# Altium project DAQ_PCB.PrjPcb
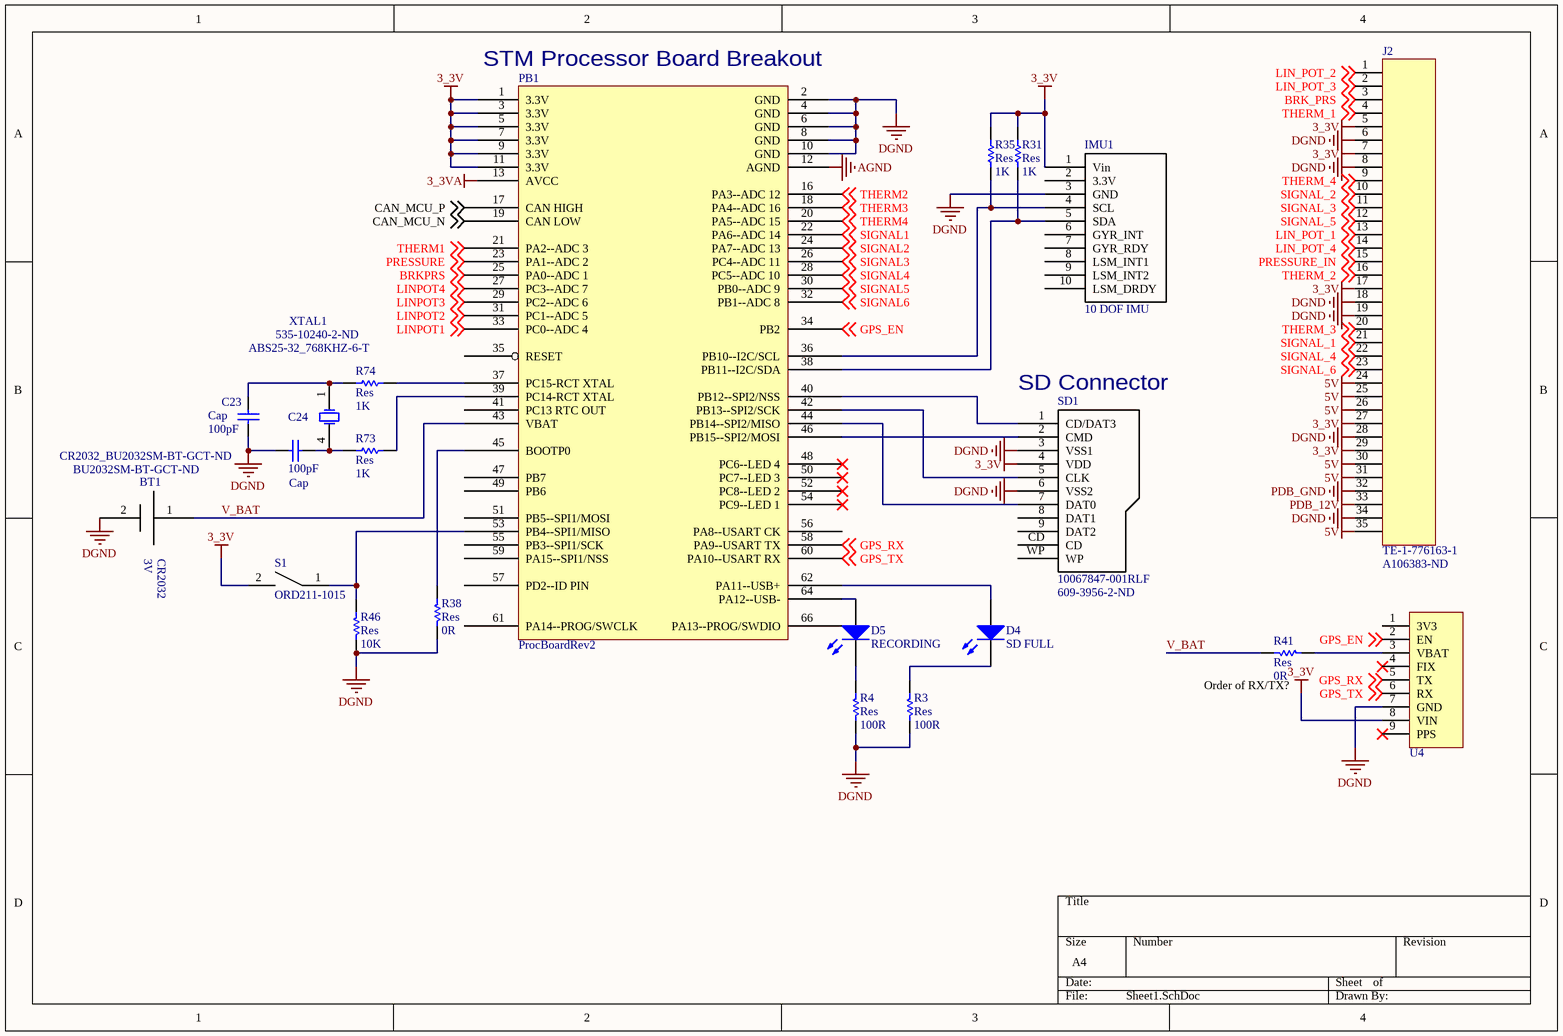
[diagram p0: Sheet1.SchDoc]
3 sheets, 156 parts. Net scope: global (net labels, ports and power ports of the same name join across sheets).
Board file: PCB1.PcbDoc
Sheets:
  Sheet1.SchDoc
  Sheet2.SchDoc
  Sheet3.SchDoc

## Sheet Sheet1.SchDoc
size A4

### Parts
BT1  CR2032_BU2032SM-BT-GCT-ND  [BU2032SM-BT-GCT-ND]
C23  Cap  value 100pF  [C0805]
C24  Cap  value 100pF  [C0805]
D4  SD FULL  [OVS5MABCR4]
D5  RECORDING  [OVS5MGBCR4]
IMU1  10 DOF IMU  [Adafruit_10DOF_IMU]
J2  TE-1-776163-1  Supplier Part Number 1: A106383-ND  [TE-1-776163-1]
PB1  ProcBoardRev2  [PROC_BOARD]
R3  Res  value 100R  [3216[1206]]
R4  Res  value 100R  [3216[1206]]
R31  Res  value 1K  [2012[0805]]
R35  Res  value 1K  [2012[0805]]
R38  Res  value 0R  [3216[1206]]  (no BOM)
R41  Res  value 0R  [3216[1206]]  (no BOM)
R46  Res  value 10K  [3216[1206]]
R73  Res  value 1K  [2012[0805]]
R74  Res  value 1K  [2012[0805]]
S1  ORD211-1015  [ORD211-1015]
SD1  10067847-001RLF  Supplier Part Number 1: 609-3956-2-ND  [10067847-001RLF]
U4  MTK3339 MODULE  [MTK3339 MODULE]  (value not drawn)
XTAL1  ABS25-32_768KHZ-6-T  Supplier Part Number 1: 535-10240-2-ND  [ABS25-32_768KHZ-6-T]

### Nets
3_3V: IMU1.1(Vin) J2.5 J2.7 J2.17 J2.27 J2.29 PB1.1(3.3V) PB1.3(3.3V) PB1.5(3.3V) PB1.7(3.3V) PB1.9(3.3V) PB1.11(3.3V) R31.1 R35.1 S1.2 SD1.4(VDD) U4.8(VIN)
3_3VA: PB1.13(AVCC)
5V: J2.24 J2.25 J2.26 J2.30 J2.31 J2.35
AGND: PB1.12(AGND)
DGND: BT1.2 C23.1 C24.2 IMU1.3(GND) J2.6 J2.8 J2.18 J2.19 J2.28 J2.34 PB1.2(GND) PB1.4(GND) PB1.6(GND) PB1.8(GND) PB1.10(GND) R3.1 R4.1 R38.1 R46.1 SD1.3(VSS1) SD1.6(VSS2) U4.7(GND)
PDB_12V: J2.33
PDB_GND: J2.32
BRK_PRS: J2.3 ; off-sheet BRK_PRS
BRKPRS: PB1.25(PA0--ADC_1) ; off-sheet BRKPRS
CAN_MCU_N: PB1.19(CAN_LOW) ; off-sheet CAN_MCU_N
CAN_MCU_P: PB1.17(CAN_HIGH) ; off-sheet CAN_MCU_P
GPS_EN: PB1.34(PB2) U4.2(EN) ; off-sheet GPS_EN
GPS_RX: PB1.58(PA9--USART_TX) U4.5(TX) ; off-sheet GPS_RX
GPS_TX: PB1.60(PA10--USART_RX) U4.6(RX) ; off-sheet GPS_TX
LIN_POT_1: J2.13 ; off-sheet LIN_POT_1
LIN_POT_2: J2.1 ; off-sheet LIN_POT_2
LIN_POT_3: J2.2 ; off-sheet LIN_POT_3
LIN_POT_4: J2.14 ; off-sheet LIN_POT_4
LINPOT1: PB1.33(PC0--ADC_4) ; off-sheet LINPOT1
LINPOT2: PB1.31(PC1--ADC_5) ; off-sheet LINPOT2
LINPOT3: PB1.29(PC2--ADC_6) ; off-sheet LINPOT3
LINPOT4: PB1.27(PC3--ADC_7) ; off-sheet LINPOT4
PRESSURE: PB1.23(PA1--ADC_2) ; off-sheet PRESSURE
PRESSURE_IN: J2.15 ; off-sheet PRESSURE_IN
SIGNAL1: PB1.22(PA6--ADC_14) ; off-sheet SIGNAL1
SIGNAL2: PB1.24(PA7--ADC_13) ; off-sheet SIGNAL2
SIGNAL3: PB1.26(PC4--ADC_11) ; off-sheet SIGNAL3
SIGNAL4: PB1.28(PC5--ADC_10) ; off-sheet SIGNAL4
SIGNAL5: PB1.30(PB0--ADC_9) ; off-sheet SIGNAL5
SIGNAL6: PB1.32(PB1--ADC_8) ; off-sheet SIGNAL6
SIGNAL_1: J2.21 ; off-sheet SIGNAL_1
SIGNAL_2: J2.10 ; off-sheet SIGNAL_2
SIGNAL_3: J2.11 ; off-sheet SIGNAL_3
SIGNAL_4: J2.22 ; off-sheet SIGNAL_4
SIGNAL_5: J2.12 ; off-sheet SIGNAL_5
SIGNAL_6: J2.23 ; off-sheet SIGNAL_6
THERM1: PB1.21(PA2--ADC_3) ; off-sheet THERM1
THERM2: PB1.16(PA3--ADC_12) ; off-sheet THERM2
THERM3: PB1.18(PA4--ADC_16) ; off-sheet THERM3
THERM4: PB1.20(PA5--ADC_15) ; off-sheet THERM4
THERM_1: J2.4 ; off-sheet THERM_1
THERM_2: J2.16 ; off-sheet THERM_2
THERM_3: J2.20 ; off-sheet THERM_3
THERM_4: J2.9 ; off-sheet THERM_4
V_BAT: BT1.1 PB1.43(VBAT) R41.2
NetC23_2: C23.2 R74.2 XTAL1.1(OSC1)
NetC24_1: C24.1 R73.2 XTAL1.4(OSC4)
NetD4_1: D4.1(A) PB1.62(PA11--USB+)
NetD4_2: D4.2(K) R3.2
NetD5_1: D5.1(A) PB1.64(PA12--USB-)
NetD5_2: D5.2(K) R4.2
NetIMU1_4: IMU1.4(SCL) PB1.36(PB10--I2C/SCL) R35.2
NetIMU1_5: IMU1.5(SDA) PB1.38(PB11--I2C/SDA) R31.2
NetPB1_37: PB1.37(PC15-RCT_XTAL) R74.1
NetPB1_39: PB1.39(PC14-RCT_XTAL) R73.1
NetPB1_40: PB1.40(PB12--SPI2/NSS) SD1.1(CD/DAT3)
NetPB1_42: PB1.42(PB13--SPI2/SCK) SD1.5(CLK)
NetPB1_44: PB1.44(PB14--SPI2/MISO) SD1.7(DAT0)
NetPB1_45: PB1.45(BOOTP0) R38.2
NetPB1_46: PB1.46(PB15--SPI2/MOSI) SD1.2(CMD)
NetPB1_53: PB1.53(PB4--SPI1/MISO) R46.2 S1.1
NetR41_1: R41.1 U4.3(VBAT)

Not connected (* = marked no-connect by the designer): IMU1 2(3.3V) 6(GYR_INT) 7(GYR_RDY) 8(LSM_INT1) 9(LSM_INT2) 10(LSM_DRDY); PB1 14(NC) 15(NC) 35(RESET) 41(PC13_RTC_OUT) 47(PB7) 48(PC6--LED_4)* 49(PB6) 50(PC7--LED_3)* 51(PB5--SPI1/MOSI) 52(PC8--LED_2)* 54(PC9--LED_1)* 55(PB3--SPI1/SCK) 56(PA8--USART_CK) 57(PD2--ID_PIN) 59(PA15--SPI1/NSS) 61(PA14--PROG/SWCLK) 63(NC) 65(NC) 66(PA13--PROG/SWDIO) 67; SD1 8(DAT1) 9(DAT2) CD WP; U4 1(3V3) 4(FIX)* 9(PPS)*

### Notes on the sheet
- (near PB1) STM Processor Board Breakout
- (near SD1) SD Connector
- (near R41) Order of RX/TX?
- (in symbol CR2032_BU2032SM-BT-GCT-ND) 3V; CR2032

### Library data of the parts
BT1 = CR2032_BU2032SM-BT-GCT-ND: Coin Cell Battery Holder_BU2032SM-BT-GCT-ND; Supplier: Digikey; Supplier 1: Digi-Key; Supplier Part Number 1: BU2032SM-BT-GCT-ND; Supplier Pt Number: BU2032SM-BT-GCT-ND
C23 C24 = Cap: Capacitor; Published: 8-Jun-2000; LatestRevisionDate: 17-Jul-2002; LatestRevisionNote: Re-released for DXP Platform.; PackageReference: C1206; Publisher: Altium Limited
D4 = OVS5MABCR4: Typical AMBER LED; Published: 8-Jun-2000; LatestRevisionDate: 17-Jul-2002; LatestRevisionNote: Re-released for DXP Platform.; PackageDocument: Feb-2002; PackageReference: 3.2X1.6X1.1; Publisher: Altium Limited; Supplier 1: Digi-Key; Colour: AMBER; Supplier Part Number 1: 365-1543-1-ND
D5 = OVS5MGBCR4: Typical GREEN LED; Published: 8-Jun-2000; LatestRevisionDate: 17-Jul-2002; LatestRevisionNote: Re-released for DXP Platform.; PackageDocument: Feb-2002; PackageReference: 3.2X1.6X1.1; Publisher: Altium Limited; Supplier 1: Digi-Key; Colour: GREEN; Supplier Part Number 1: 365-1545-1-ND
IMU1 = Adafruit_10DOF_IMU
J2 = TE-1-776163-1: CONN HEADER 35POS R/A GOLD BLACK; Supplier 1: Digi-Key
PB1 = ProcBoardRev2: Processor board that carries the STM32F072RB
R3 R4 R31 R35 R38 R41 R46 R73 R74 = Res: Surface Mount Resistor; Published: 8-Jun-2000; LatestRevisionDate: 17-Jul-2002; LatestRevisionNote: Re-released for DXP Platform.; PackageReference: AXIAL-0.5; Publisher: Altium Limited
S1 = ORD211-1015: REED Switch; Manufacturer: Standex-Meder Electronics; Circuit: SPST-NO; Operate Range: 10 ~ 15AT; Current - Switching: 100mA (AC/DC); Voltage - Switching AC: 24V; Power - Rated: 1VA; Operate Time: 0.3ms; Release Time: 0.05ms; Capacitance: 0.20pF; Current - Carry: 300mA (AC/DC); Supplier 1: Digi-Key; Supplier Part Number 1: 374-1083-ND; RoHS: RoHS Compliant; Category: Switches; Stock 1: 4721; Pricing 1: 1=1.15, 10=1.007, 25=0.9664, 50=0.906, 100=0.8858, 250=0.7046, 500=0.64422, 1000=0.62409, 5000=0.56369 (CAD); Packaging: Bulk; Type: Glass Body; Release Range: -; Voltage - Switching DC: 24V; Mounting Type: Through Hole; Termination Style: Axial; Length - Overall: 1.406" (35.70mm); Size - Body: 0.079" Dia x 0.394" L (2.00mm x 10.00mm); Height Above Board: -; Operating Temperature: -; ComponentLink1URL: https://standexelectronics.com/wp-content/uploads/OKI_Reed_Switch_ORD211.pdf; ComponentLink1Description: https://standexelectronics.com/wp-content/uploads/OKI_Reed_Switch_ORD211.pdf; Manufacturer Part Number: ORD211-1015
SD1 = 10067847-001RLF: SD Card Connector; Supplier 1: Digi-Key
U4 = MTK3339 MODULE: GPS Module Breakout
XTAL1 = ABS25-32_768KHZ-6-T: 32.768KHz Crystal Oscillator; Supplier 1: Digi-Key

## Sheet Sheet2.SchDoc
size A2
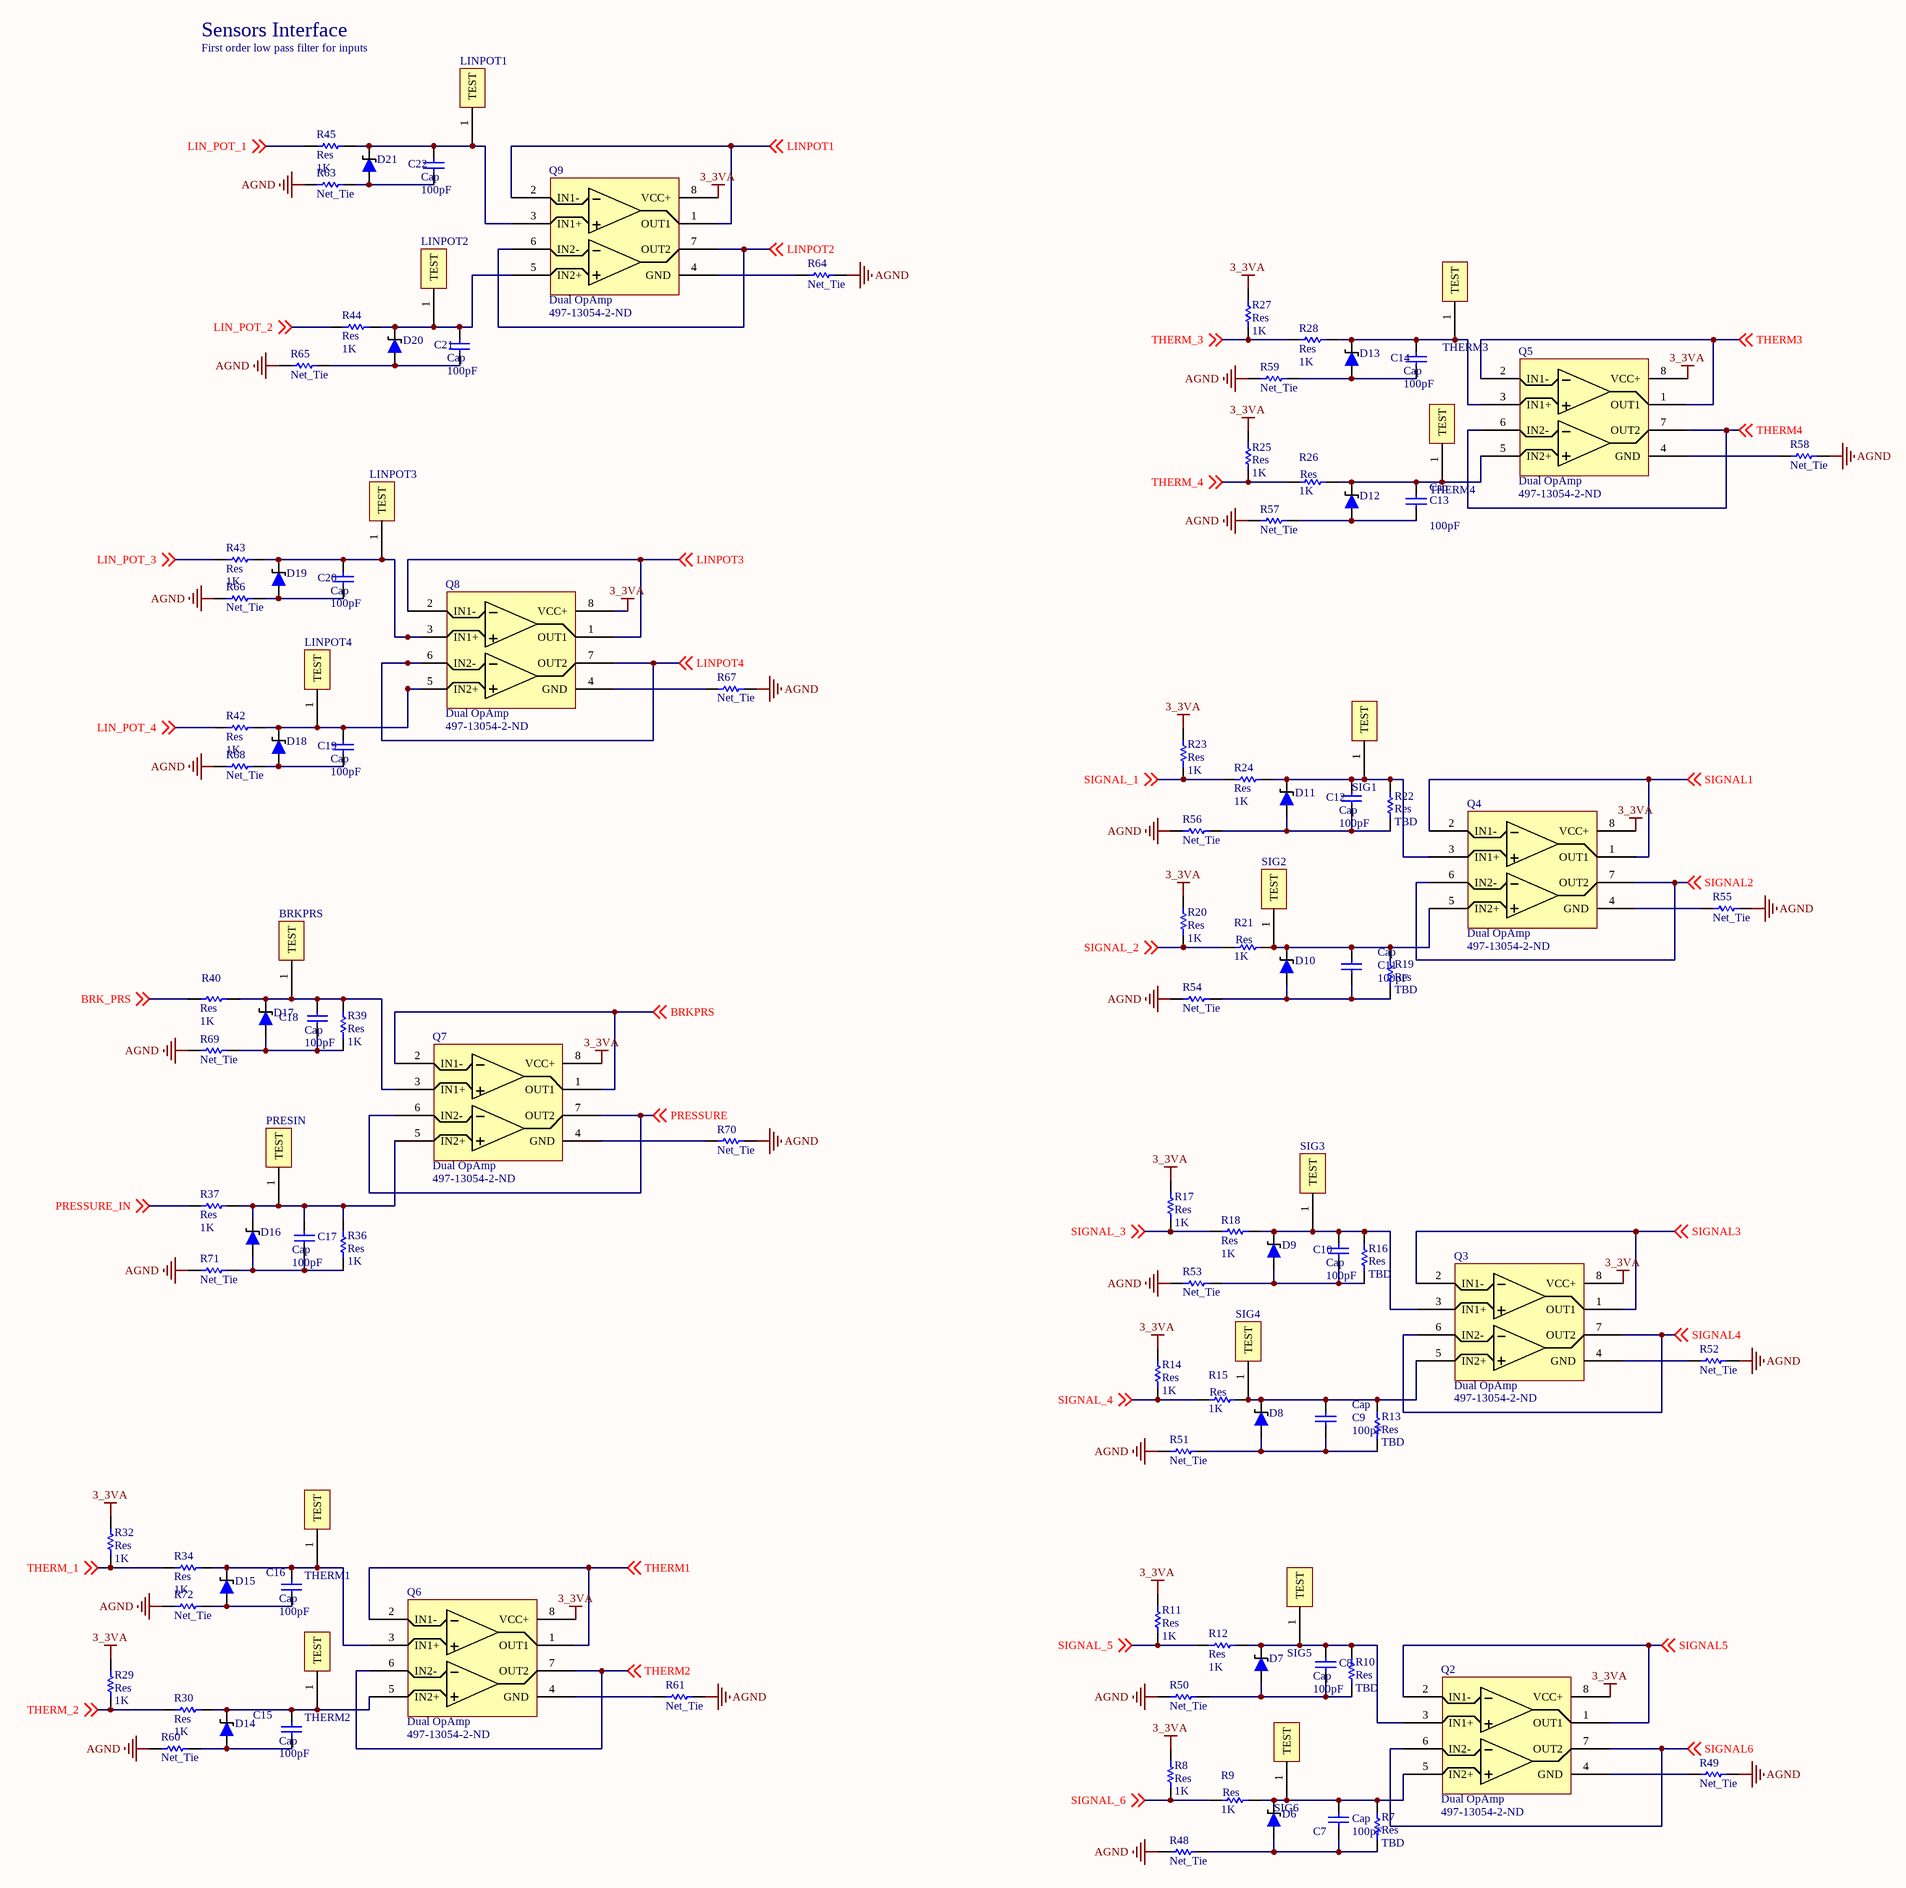
[diagram p1: Sheet2.SchDoc]

### Parts
C7  Cap  value 100pF  [C0805]
C8  Cap  value 100pF  [C0805]
C9  Cap  value 100pF  [C0805]
C10  Cap  value 100pF  [C0805]
C11  Cap  value 100pF  [C0805]
C12  Cap  value 100pF  [C0805]
C13  Cap  value 100pF  [C0805]
C14  Cap  value 100pF  [C0805]
C15  Cap  value 100pF  [C0805]
C16  Cap  value 100pF  [C0805]
C17  Cap  value 100pF  [C0805]
C18  Cap  value 100pF  [C0805]
C19  Cap  value 100pF  [C0805]
C20  Cap  value 100pF  [C0805]
C21  Cap  value 100pF  [C0805]
C22  Cap  value 100pF  [C0805]
D6  MMSZ4684-TP  [MMSZ4684/9]  (value not drawn)
D7  MMSZ4684-TP  [MMSZ4684/9]  (value not drawn)
D8  MMSZ4684-TP  [MMSZ4684/9]  (value not drawn)
D9  MMSZ4684-TP  [MMSZ4684/9]  (value not drawn)
D10  MMSZ4684-TP  [MMSZ4684/9]  (value not drawn)
D11  MMSZ4684-TP  [MMSZ4684/9]  (value not drawn)
D12  MMSZ4684-TP  [MMSZ4684/9]  (value not drawn)
D13  MMSZ4684-TP  [MMSZ4684/9]  (value not drawn)
D14  MMSZ4684-TP  [MMSZ4684/9]  (value not drawn)
D15  MMSZ4684-TP  [MMSZ4684/9]  (value not drawn)
D16  MMSZ4689-TP  [MMSZ4684/9]  (value not drawn)
D17  MMSZ4689-TP  [MMSZ4684/9]  (value not drawn)
D18  MMSZ4684-TP  [MMSZ4684/9]  (value not drawn)
D19  MMSZ4684-TP  [MMSZ4684/9]  (value not drawn)
D20  MMSZ4684-TP  [MMSZ4684/9]  (value not drawn)
D21  MMSZ4684-TP  [MMSZ4684/9]  (value not drawn)
Q2  Dual OpAmp  Supplier Part Number 1: 497-13054-2-ND  [LMV358LIDT]
Q3  Dual OpAmp  Supplier Part Number 1: 497-13054-2-ND  [LMV358LIDT]
Q4  Dual OpAmp  Supplier Part Number 1: 497-13054-2-ND  [LMV358LIDT]
Q5  Dual OpAmp  Supplier Part Number 1: 497-13054-2-ND  [LMV358LIDT]
Q6  Dual OpAmp  Supplier Part Number 1: 497-13054-2-ND  [LMV358LIDT]
Q7  Dual OpAmp  Supplier Part Number 1: 497-13054-2-ND  [LMV358LIDT]
Q8  Dual OpAmp  Supplier Part Number 1: 497-13054-2-ND  [LMV358LIDT]
Q9  Dual OpAmp  Supplier Part Number 1: 497-13054-2-ND  [LMV358LIDT]
R7  Res  value TBD  [2012[0805]]  (no BOM)
R8  Res  value 1K  [2012[0805]]
R9  Res  value 1K  [2012[0805]]
R10  Res  value TBD  [2012[0805]]  (no BOM)
R11  Res  value 1K  [2012[0805]]
R12  Res  value 1K  [2012[0805]]
R13  Res  value TBD  [2012[0805]]  (no BOM)
R14  Res  value 1K  [2012[0805]]
R15  Res  value 1K  [2012[0805]]
R16  Res  value TBD  [2012[0805]]  (no BOM)
R17  Res  value 1K  [2012[0805]]
R18  Res  value 1K  [2012[0805]]
R19  Res  value TBD  [2012[0805]]  (no BOM)
R20  Res  value 1K  [2012[0805]]
R21  Res  value 1K  [2012[0805]]
R22  Res  value TBD  [2012[0805]]  (no BOM)
R23  Res  value 1K  [2012[0805]]
R24  Res  value 1K  [2012[0805]]
R25  Res  value 1K  [2012[0805]]
R26  Res  value 1K  [2012[0805]]
R27  Res  value 1K  [2012[0805]]
R28  Res  value 1K  [2012[0805]]
R29  Res  value 1K  [2012[0805]]
R30  Res  value 1K  [2012[0805]]
R32  Res  value 1K  [2012[0805]]
R34  Res  value 1K  [2012[0805]]
R36  Res  value 1K  [2012[0805]]
R37  Res  value 1K  [2012[0805]]
R39  Res  value 1K  [2012[0805]]
R40  Res  value 1K  [2012[0805]]
R42  Res  value 1K  [2012[0805]]
R43  Res  value 1K  [2012[0805]]
R44  Res  value 1K  [2012[0805]]
R45  Res  value 1K  [2012[0805]]
R48  Net_Tie  [NetTie 0805 10mil]  (net tie, no BOM)
R49  Net_Tie  [NetTie 0805 10mil]  (net tie, no BOM)
R50  Net_Tie  [NetTie 0805 10mil]  (net tie, no BOM)
R51  Net_Tie  [NetTie 0805 10mil]  (net tie, no BOM)
R52  Net_Tie  [NetTie 0805 10mil]  (net tie, no BOM)
R53  Net_Tie  [NetTie 0805 10mil]  (net tie, no BOM)
R54  Net_Tie  [NetTie 0805 10mil]  (net tie, no BOM)
R55  Net_Tie  [NetTie 0805 10mil]  (net tie, no BOM)
R56  Net_Tie  [NetTie 0805 10mil]  (net tie, no BOM)
R57  Net_Tie  [NetTie 0805 10mil]  (net tie, no BOM)
R58  Net_Tie  [NetTie 0805 10mil]  (net tie, no BOM)
R59  Net_Tie  [NetTie 0805 10mil]  (net tie, no BOM)
R60  Net_Tie  [NetTie 0805 10mil]  (net tie, no BOM)
R61  Net_Tie  [NetTie 0805 10mil]  (net tie, no BOM)
R63  Net_Tie  [NetTie 0805 10mil]  (net tie, no BOM)
R64  Net_Tie  [NetTie 0805 10mil]  (net tie, no BOM)
R65  Net_Tie  [NetTie 0805 10mil]  (net tie, no BOM)
R66  Net_Tie  [NetTie 0805 10mil]  (net tie, no BOM)
R67  Net_Tie  [NetTie 0805 10mil]  (net tie, no BOM)
R68  Net_Tie  [NetTie 0805 10mil]  (net tie, no BOM)
R69  Net_Tie  [NetTie 0805 10mil]  (net tie, no BOM)
R70  Net_Tie  [NetTie 0805 10mil]  (net tie, no BOM)
R71  Net_Tie  [NetTie 0805 10mil]  (net tie, no BOM)
R72  Net_Tie  [NetTie 0805 10mil]  (net tie, no BOM)
TP1  SIG6  [TEST POINT 5000K]
TP2  SIG5  [TEST POINT 5000K]
TP3  SIG4  [TEST POINT 5000K]
TP4  SIG3  [TEST POINT 5000K]
TP5  SIG2  [TEST POINT 5000K]
TP6  SIG1  [TEST POINT 5000K]
TP7  THERM4  [TEST POINT 5000K]
TP8  THERM3  [TEST POINT 5000K]
TP9  THERM2  [TEST POINT 5000K]
TP10  THERM1  [TEST POINT 5000K]
TP11  PRESIN  [TEST POINT 5000K]
TP12  BRKPRS  [TEST POINT 5000K]
TP13  LINPOT4  [TEST POINT 5000K]
TP14  LINPOT3  [TEST POINT 5000K]
TP15  LINPOT2  [TEST POINT 5000K]
TP16  LINPOT1  [TEST POINT 5000K]

### Nets
3_3VA: Q2.8(VCC+) Q3.8(VCC+) Q4.8(VCC+) Q5.8(VCC+) Q6.8(VCC+) Q7.8(VCC+) Q8.8(VCC+) Q9.8(VCC+) R8.2 R11.2 R14.2 R17.2 R20.2 R23.2 R25.2 R27.2 R29.2 R32.2
AGND: R48.2 R49.2 R50.2 R51.2 R52.2 R53.2 R54.2 R55.2 R56.2 R57.2 R58.2 R59.2 R60.2 R61.2 R63.1 R64.2 R65.1 R66.2 R67.2 R68.2 R69.2 R70.2 R71.2 R72.2
BRK_PRS: R40.1 ; off-sheet BRK_PRS
BRKPRS: Q7.1(OUT1) Q7.2(IN1-) ; off-sheet BRKPRS
LIN_POT_1: R45.1 ; off-sheet LIN_POT_1
LIN_POT_2: R44.1 ; off-sheet LIN_POT_2
LIN_POT_3: R43.1 ; off-sheet LIN_POT_3
LIN_POT_4: R42.1 ; off-sheet LIN_POT_4
LINPOT1: Q9.1(OUT1) Q9.2(IN1-) ; off-sheet LINPOT1
LINPOT2: Q9.6(IN2-) Q9.7(OUT2) ; off-sheet LINPOT2
LINPOT3: Q8.1(OUT1) Q8.2(IN1-) ; off-sheet LINPOT3
LINPOT4: Q8.6(IN2-) Q8.7(OUT2) ; off-sheet LINPOT4
PRESSURE: Q7.6(IN2-) Q7.7(OUT2) ; off-sheet PRESSURE
PRESSURE_IN: R37.1 ; off-sheet PRESSURE_IN
SIGNAL1: Q4.1(OUT1) Q4.2(IN1-) ; off-sheet SIGNAL1
SIGNAL2: Q4.6(IN2-) Q4.7(OUT2) ; off-sheet SIGNAL2
SIGNAL3: Q3.1(OUT1) Q3.2(IN1-) ; off-sheet SIGNAL3
SIGNAL4: Q3.6(IN2-) Q3.7(OUT2) ; off-sheet SIGNAL4
SIGNAL5: Q2.1(OUT1) Q2.2(IN1-) ; off-sheet SIGNAL5
SIGNAL6: Q2.6(IN2-) Q2.7(OUT2) ; off-sheet SIGNAL6
SIGNAL_1: R23.1 R24.1 ; off-sheet SIGNAL_1
SIGNAL_2: R20.1 R21.1 ; off-sheet SIGNAL_2
SIGNAL_3: R17.1 R18.1 ; off-sheet SIGNAL_3
SIGNAL_4: R14.1 R15.1 ; off-sheet SIGNAL_4
SIGNAL_5: R11.1 R12.1 ; off-sheet SIGNAL_5
SIGNAL_6: R8.1 R9.1 ; off-sheet SIGNAL_6
THERM1: Q6.1(OUT1) Q6.2(IN1-) ; off-sheet THERM1
THERM2: Q6.6(IN2-) Q6.7(OUT2) ; off-sheet THERM2
THERM3: Q5.1(OUT1) Q5.2(IN1-) ; off-sheet THERM3
THERM4: Q5.6(IN2-) Q5.7(OUT2) ; off-sheet THERM4
THERM_1: R32.1 R34.1 ; off-sheet THERM_1
THERM_2: R29.1 R30.1 ; off-sheet THERM_2
THERM_3: R27.1 R28.1 ; off-sheet THERM_3
THERM_4: R25.1 R26.1 ; off-sheet THERM_4
NetC7_1: C7.1 D6.1 R7.2 R48.1
NetC7_2: C7.2 D6.2 Q2.5(IN2+) R7.1 R9.2 TP1.1(TEST)
NetC8_1: C8.1 D7.1 R10.2 R50.1
NetC8_2: C8.2 D7.2 Q2.3(IN1+) R10.1 R12.2 TP2.1(TEST)
NetC9_1: C9.1 D8.1 R13.2 R51.1
NetC9_2: C9.2 D8.2 Q3.5(IN2+) R13.1 R15.2 TP3.1(TEST)
NetC10_1: C10.1 D9.1 R16.2 R53.1
NetC10_2: C10.2 D9.2 Q3.3(IN1+) R16.1 R18.2 TP4.1(TEST)
NetC11_1: C11.1 D10.1 R19.2 R54.1
NetC11_2: C11.2 D10.2 Q4.5(IN2+) R19.1 R21.2 TP5.1(TEST)
NetC12_1: C12.1 D11.1 R22.2 R56.1
NetC12_2: C12.2 D11.2 Q4.3(IN1+) R22.1 R24.2 TP6.1(TEST)
NetC13_1: C13.1 D12.1 R57.1
NetC13_2: C13.2 D12.2 Q5.5(IN2+) R26.2 TP7.1(TEST)
NetC14_1: C14.1 D13.1 R59.1
NetC14_2: C14.2 D13.2 Q5.3(IN1+) R28.2 TP8.1(TEST)
NetC15_1: C15.1 D14.1 R60.1
NetC15_2: C15.2 D14.2 Q6.5(IN2+) R30.2 TP9.1(TEST)
NetC16_1: C16.1 D15.1 R72.1
NetC16_2: C16.2 D15.2 Q6.3(IN1+) R34.2 TP10.1(TEST)
NetC17_1: C17.1 D16.1 R36.1 R71.1
NetC17_2: C17.2 D16.2 Q7.5(IN2+) R36.2 R37.2 TP11.1(TEST)
NetC18_1: C18.1 D17.1 R39.1 R69.1
NetC18_2: C18.2 D17.2 Q7.3(IN1+) R39.2 R40.2 TP12.1(TEST)
NetC19_1: C19.1 D18.1 R68.1
NetC19_2: C19.2 D18.2 Q8.5(IN2+) R42.2 TP13.1(TEST)
NetC20_1: C20.1 D19.1 R66.1
NetC20_2: C20.2 D19.2 Q8.3(IN1+) R43.2 TP14.1(TEST)
NetC21_1: C21.1 D20.1 R65.2
NetC21_2: C21.2 D20.2 Q9.5(IN2+) R44.2 TP15.1(TEST)
NetC22_1: C22.1 D21.1 R63.2
NetC22_2: C22.2 D21.2 Q9.3(IN1+) R45.2 TP16.1(TEST)
NetQ2_4: Q2.4(GND) R49.1
NetQ3_4: Q3.4(GND) R52.1
NetQ4_4: Q4.4(GND) R55.1
NetQ5_4: Q5.4(GND) R58.1
NetQ6_4: Q6.4(GND) R61.1
NetQ7_4: Q7.4(GND) R70.1
NetQ8_4: Q8.4(GND) R67.1
NetQ9_4: Q9.4(GND) R64.1

### Notes on the sheet
- Sensors Interface
- First order low pass filter for inputs

### Library data of the parts
C7-C22 = Cap: Capacitor; Published: 8-Jun-2000; LatestRevisionDate: 17-Jul-2002; LatestRevisionNote: Re-released for DXP Platform.; PackageReference: C1206; Publisher: Altium Limited
D6-D15 D18-D21 = MMSZ4684-TP: Zener Diode 3.3; Supplier 1: Digi-Key; Supplier Part Number 1: MMSZ4684-TPMSTR-ND
D16 D17 = MMSZ4689-TP: Zener Diode 5.1; Supplier 1: Digi-Key
Q2-Q9 = LMV358LIDT: Standard Dual OpAmp; Supplier 1: Digi-Key
R7-R30 R32 R34 R36 R37 R39 R40 R42-R45 = Res: Surface Mount Resistor; Published: 8-Jun-2000; LatestRevisionDate: 17-Jul-2002; LatestRevisionNote: Re-released for DXP Platform.; PackageReference: AXIAL-0.5; Publisher: Altium Limited
R48-R61 R63-R72 = Res_NetTie: Surface Mount Resistor
TP1-TP16 = Test Point: 5000-5004, 5015-5019 Keystone Electronics

## Sheet Sheet3.SchDoc
size A4
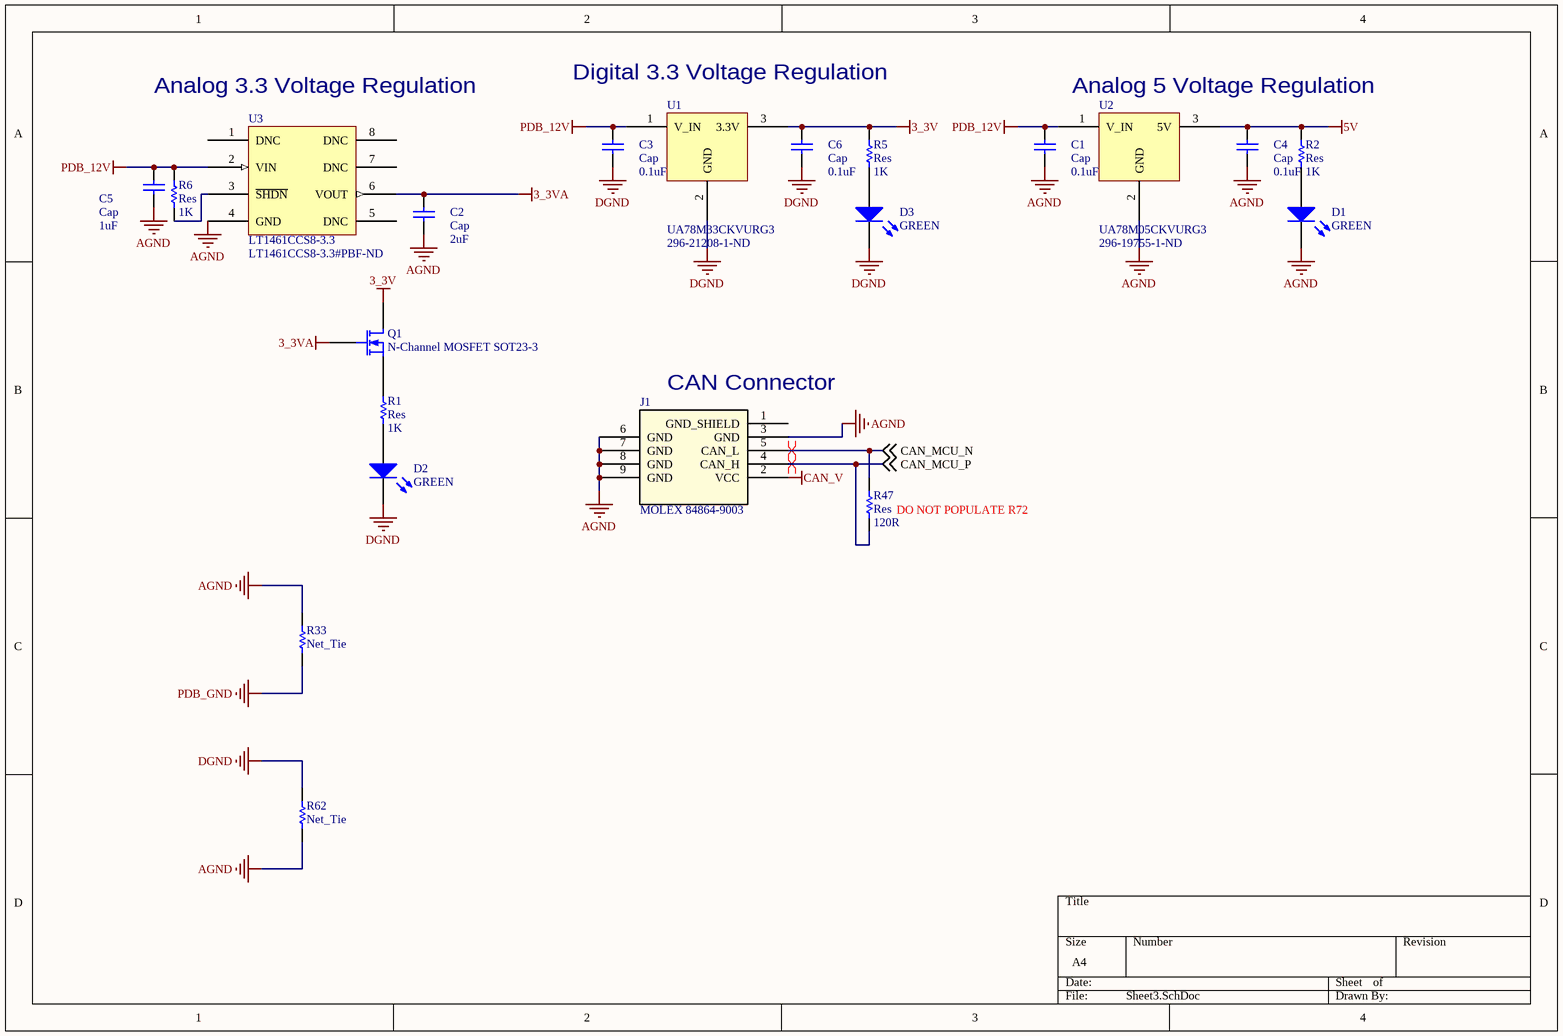
[diagram p2: Sheet3.SchDoc]

### Parts
C1  Cap  value 0.1uF  [C1206]
C2  Cap  value 2uF  [C1206]
C3  Cap  value 0.1uF  [C1206]
C4  Cap  value 0.1uF  [C1206]
C5  Cap  value 1uF  [C1206]
C6  Cap  value 0.1uF  [C1206]
D1  Colour: GREEN  [OVS5MGBCR4]  (hidden comment: OVS5MGBCR4)
D2  Colour: GREEN  [OVS5MGBCR4]  (hidden comment: OVS5MGBCR4)
D3  Colour: GREEN  [OVS5MGBCR4]  (hidden comment: OVS5MGBCR4)
J1  MOLEX 84864-9003  [MOLEX 84864-9003]
Q1  N-Channel MOSFET SOT23-3  [SOT23-3]
R1  Res  value 1K  [2012[0805]]
R2  Res  value 1K  [2012[0805]]
R5  Res  value 1K  [2012[0805]]
R6  Res  value 1K  [2012[0805]]
R33  Net_Tie  [NetTie 0805 40mil]  (net tie, no BOM)
R47  Res  value 120R  [2012[0805]]  (no BOM)
R62  Net_Tie  [NetTie 0805 40mil]  (net tie, no BOM)
U1  UA78M33CKVURG3  Supplier Part Number 1: 296-21208-1-ND  [TO-252-3]
U2  UA78M05CKVURG3  Supplier Part Number 1: 296-19755-1-ND  [TO-252-3]
U3  LT1461CCS8-3.3  Supplier Part Number 1: LT1461CCS8-3.3#PBF-ND  [SOIC-8-150]

### Nets
3_3V: C6.2 Q1.3(D) R5.2 U1.3(3.3V)
3_3VA: C2.2 Q1.1(G) U3.6(VOUT)
5V: C4.2 R2.2 U2.3(5V)
AGND: C1.1 C2.1 C4.1 C5.1 D1.2(K) J1.3(GND) J1.6(GND) J1.7(GND) J1.8(GND) J1.9(GND) R33.2 R62.1 U2.2(GND) U3.4(GND)
CAN_V: J1.2(VCC)
DGND: C3.1 C6.1 D2.2(K) D3.2(K) R62.2 U1.2(GND)
PDB_12V: C1.2 C3.2 C5.2 R6.2 U1.1(V_IN) U2.1(V_IN) U3.2(VIN)
PDB_GND: R33.1
CAN_MCU_N: J1.5(CAN_L) R47.1 ; off-sheet CAN_MCU_N
CAN_MCU_P: J1.4(CAN_H) R47.2 ; off-sheet CAN_MCU_P
NetD1_1: D1.1(A) R2.1
NetD2_1: D2.1(A) R1.1
NetD3_1: D3.1(A) R5.1
NetQ1_2: Q1.2(S) R1.2
NetR6_1: R6.1 U3.3(~{SHDN})

Not connected (* = marked no-connect by the designer): J1 1(GND_SHIELD); U3 1(DNC) 5(DNC) 7(DNC) 8(DNC)

### Layout directives
differential pair: (no net found under the mark)

### Notes on the sheet
- (near U3) Analog 3.3 Voltage Regulation
- Digital 3.3 Voltage Regulation
- Analog 5 Voltage Regulation
- (near J1) CAN Connector
- (near R47) DO NOT POPULATE R72

### Library data of the parts
C1-C6 = Cap: Capacitor; Published: 8-Jun-2000; LatestRevisionDate: 17-Jul-2002; LatestRevisionNote: Re-released for DXP Platform.; PackageReference: C1206; Publisher: Altium Limited
D1-D3 = OVS5MGBCR4: Typical GREEN LED; Published: 8-Jun-2000; LatestRevisionDate: 17-Jul-2002; LatestRevisionNote: Re-released for DXP Platform.; PackageDocument: Feb-2002; PackageReference: 3.2X1.6X1.1; Publisher: Altium Limited; Supplier 1: Digi-Key; Supplier Part Number 1: 365-1545-1-ND
J1 = MOLEX 84864-9003: CAN Micro-Change M12, Right Angle, Male
Q1 = MOSFET-N SOT23-3
R1 R2 R5 R6 R47 = Res: Surface Mount Resistor; Published: 8-Jun-2000; LatestRevisionDate: 17-Jul-2002; LatestRevisionNote: Re-released for DXP Platform.; PackageReference: AXIAL-0.5; Publisher: Altium Limited
R33 R62 = Res_NetTie: Surface Mount Resistor
U1 = UA78M33CKVURG3: 3.3V Regulator; Supplier 1: Digi-Key
U2 = UA78M05CKVURG3: 5.0V Regulator; Supplier 1: Digi-Key
U3 = LT1461CCS8-3.3: IC VREF SERIES 3.3V 8SOIC; Supplier 1: Digi-Key

## Nets that join several sheets
3_3V: Sheet1 (17 pins), Sheet3 (C6.2 Q1.3 R5.2 U1.3)
3_3VA: Sheet1 (PB1.13), Sheet2 (18 pins), Sheet3 (C2.2 Q1.1 U3.6)
5V: Sheet1 (6 pins), Sheet3 (C4.2 R2.2 U2.3)
AGND: Sheet1 (PB1.12), Sheet2 (24 pins), Sheet3 (14 pins)
DGND: Sheet1 (22 pins), Sheet3 (6 pins)
PDB_12V: Sheet1 (J2.33), Sheet3 (7 pins)
PDB_GND: Sheet1 (J2.32), Sheet3 (R33.1)
BRK_PRS: Sheet1 (J2.3), Sheet2 (R40.1)
BRKPRS: Sheet1 (PB1.25), Sheet2 (Q7.1 Q7.2)
CAN_MCU_N: Sheet1 (PB1.19), Sheet3 (J1.5 R47.1)
CAN_MCU_P: Sheet1 (PB1.17), Sheet3 (J1.4 R47.2)
LIN_POT_1: Sheet1 (J2.13), Sheet2 (R45.1)
LIN_POT_2: Sheet1 (J2.1), Sheet2 (R44.1)
LIN_POT_3: Sheet1 (J2.2), Sheet2 (R43.1)
LIN_POT_4: Sheet1 (J2.14), Sheet2 (R42.1)
LINPOT1: Sheet1 (PB1.33), Sheet2 (Q9.1 Q9.2)
LINPOT2: Sheet1 (PB1.31), Sheet2 (Q9.6 Q9.7)
LINPOT3: Sheet1 (PB1.29), Sheet2 (Q8.1 Q8.2)
LINPOT4: Sheet1 (PB1.27), Sheet2 (Q8.6 Q8.7)
PRESSURE: Sheet1 (PB1.23), Sheet2 (Q7.6 Q7.7)
PRESSURE_IN: Sheet1 (J2.15), Sheet2 (R37.1)
SIGNAL1: Sheet1 (PB1.22), Sheet2 (Q4.1 Q4.2)
SIGNAL2: Sheet1 (PB1.24), Sheet2 (Q4.6 Q4.7)
SIGNAL3: Sheet1 (PB1.26), Sheet2 (Q3.1 Q3.2)
SIGNAL4: Sheet1 (PB1.28), Sheet2 (Q3.6 Q3.7)
SIGNAL5: Sheet1 (PB1.30), Sheet2 (Q2.1 Q2.2)
SIGNAL6: Sheet1 (PB1.32), Sheet2 (Q2.6 Q2.7)
SIGNAL_1: Sheet1 (J2.21), Sheet2 (R23.1 R24.1)
SIGNAL_2: Sheet1 (J2.10), Sheet2 (R20.1 R21.1)
SIGNAL_3: Sheet1 (J2.11), Sheet2 (R17.1 R18.1)
SIGNAL_4: Sheet1 (J2.22), Sheet2 (R14.1 R15.1)
SIGNAL_5: Sheet1 (J2.12), Sheet2 (R11.1 R12.1)
SIGNAL_6: Sheet1 (J2.23), Sheet2 (R8.1 R9.1)
THERM1: Sheet1 (PB1.21), Sheet2 (Q6.1 Q6.2)
THERM2: Sheet1 (PB1.16), Sheet2 (Q6.6 Q6.7)
THERM3: Sheet1 (PB1.18), Sheet2 (Q5.1 Q5.2)
THERM4: Sheet1 (PB1.20), Sheet2 (Q5.6 Q5.7)
THERM_1: Sheet1 (J2.4), Sheet2 (R32.1 R34.1)
THERM_2: Sheet1 (J2.16), Sheet2 (R29.1 R30.1)
THERM_3: Sheet1 (J2.20), Sheet2 (R27.1 R28.1)
THERM_4: Sheet1 (J2.9), Sheet2 (R25.1 R26.1)